# Altium schematic sheet Main_MPPT.SchDoc
size 381 x 241 mm; SheetNumber: 1; SheetTotal: 7
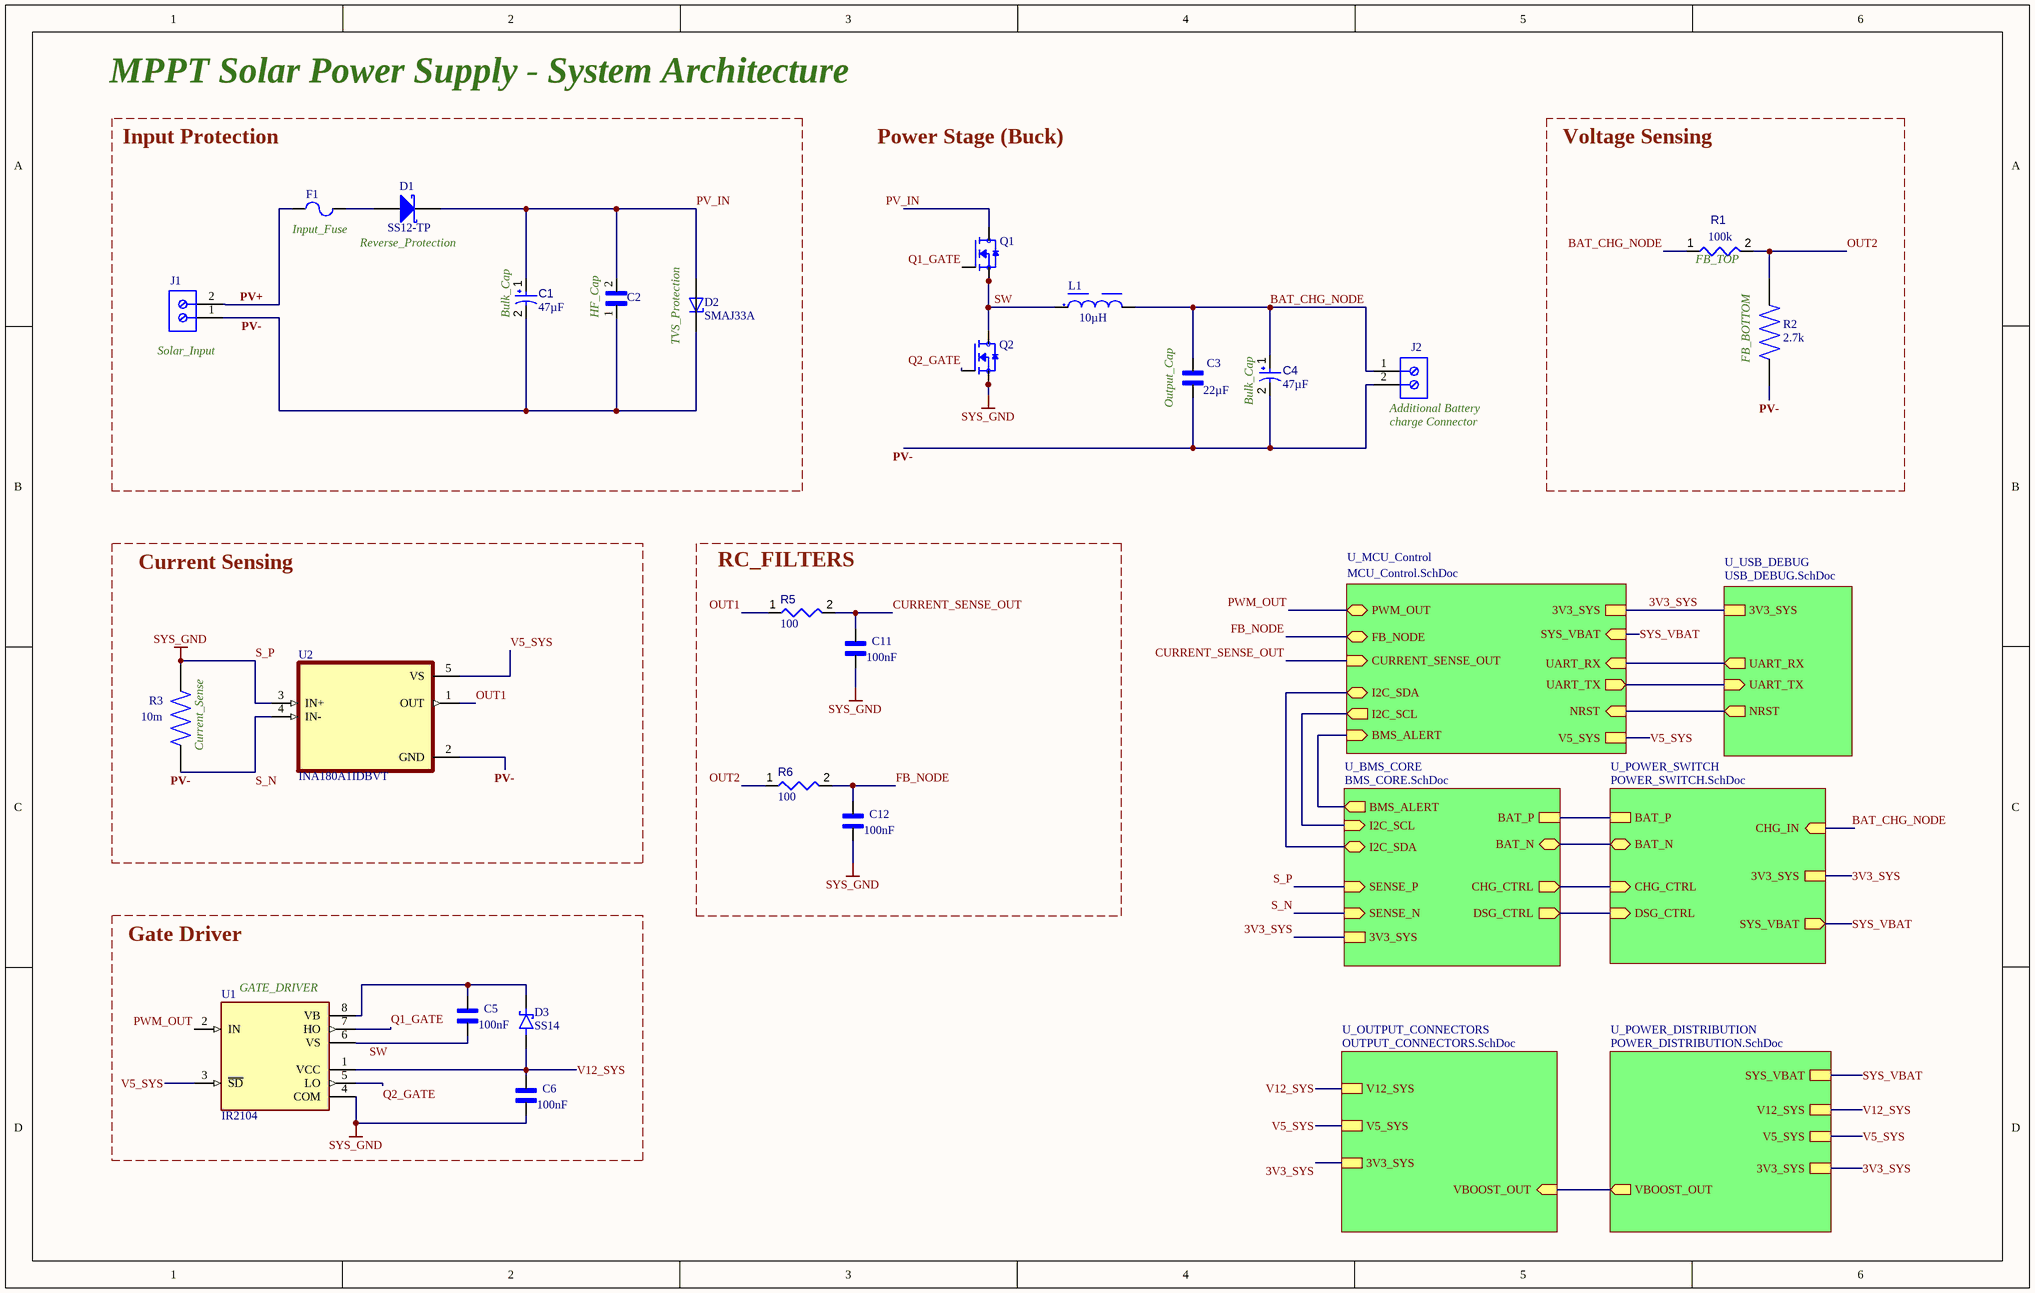
[diagram p0: Main_MPPT.SchDoc]

## Parts
C1  value 47µF  [CAPPR55-250-1120X630X1220]  (hidden comment: ECA1HM470)
C2  C3216X7R1H106K160AE  [CAPC3216X190N]  (value not drawn)
C3  value 22µF  [CAPC3225X270N]  (hidden comment: GRM32ER71E226KE15L)
C4  value 47µF  [CAPPR55-250-1120X630X1220]  (hidden comment: ECA1HM470)
C5  value 100nF  [CAPC1608X90N]  (hidden comment: 0603YC104KAZ2A)
C6  value 100nF  [CAPC1608X90N]  (hidden comment: 0603YC104KAZ2A)
C11  value 100nF  [CAPC1608X90N]  (hidden comment: 0603YC104KAZ2A)
C12  value 100nF  [CAPC1608X90N]  (hidden comment: 0603YC104KAZ2A)
D1  SS12-TP  [MCC-DO-214AC-2_V]
D2  SMAJ33A  [Copy of DIOM4325X250N]
D3  SS14  [DIOM4325X250N]
F1  0154001.DR  [LFUS-0154001.DR_V]  (value not drawn)
J1  691254810002  [691254810002]  (value not drawn)
J2  691254810002  [691254810002]  (value not drawn)
L1  value 10µH  [WE-PD_1260]  (hidden comment: WE-PD_1260)
Q1  CSD18540Q5BT  [TRANS_CSD18540Q5BT]  (value not drawn)
Q2  CSD18540Q5BT  [TRANS_CSD18540Q5BT]  (value not drawn)
R1  value 100k  [RESC0402(1005)_L]  (hidden comment: 100KR2F)
R2  value 2.7k  [RES_ERJ2RHD2702X]  (hidden comment: ERJ2RHD2702X)
R3  value 10m  [RESC6331X88N]  (hidden comment: WSL2512R0100FEA18)
R5  value 100  [RESC0402(1005)_L]  (hidden comment: 100R2F)
R6  value 100  [RESC0402(1005)_L]  (hidden comment: 100R2F)
U1  IR2104  [DIP762W45P254L988H533Q8]
U2  INA180A1IDBVT  [SOT95P280X145-5N]

## Blocks framed on the sheet
Input Protection: C1 C2 D1 D2 F1 J1
Voltage Sensing: R1 R2
Current Sensing: R3 U2
RC_FILTERS: C11 C12 R5 R6
Gate Driver: C5 C6 D3 U1

## Sub-sheets
U_BMS_CORE = BMS_CORE.SchDoc: BAT_N (bidir), BMS_ALERT (out), I2C_SCL (in), I2C_SDA (bidir), CHG_CTRL (out), SENSE_N (in), SENSE_P (in), BAT_P, DSG_CTRL (out), 3V3_SYS
U_MCU_Control = MCU_Control.SchDoc: PWM_OUT (bidir), FB_NODE (bidir), CURRENT_SENSE_OUT (in), I2C_SDA (bidir), I2C_SCL (out), BMS_ALERT (in), 3V3_SYS, V5_SYS, SYS_VBAT (in), UART_TX (out), UART_RX (in), NRST (in)
U_OUTPUT_CONNECTORS = OUTPUT_CONNECTORS.SchDoc: VBOOST_OUT (in), V12_SYS, V5_SYS, 3V3_SYS
U_POWER_DISTRIBUTION = POWER_DISTRIBUTION.SchDoc: SYS_VBAT, V5_SYS, 3V3_SYS, VBOOST_OUT (out), V12_SYS
U_POWER_SWITCH = POWER_SWITCH.SchDoc: CHG_CTRL (in), DSG_CTRL (in), BAT_P, BAT_N (bidir), CHG_IN (in), SYS_VBAT (out), 3V3_SYS
U_USB_DEBUG = USB_DEBUG.SchDoc: 3V3_SYS, UART_TX (in), UART_RX (out), NRST (out)

## Nets
S_P: C6.1 C11.1 C12.1 Q2.1(S) Q2.2(S) Q2.3(S) R3.2 U1.4(COM) U2.3(IN+) ; sheet U_BMS_CORE/SENSE_P  [also labelled SYS_GND]
3V3_SYS: sheet U_MCU_Control/3V3_SYS, sheet U_BMS_CORE/3V3_SYS, sheet U_POWER_SWITCH/3V3_SYS, sheet U_POWER_DISTRIBUTION/3V3_SYS, sheet U_OUTPUT_CONNECTORS/3V3_SYS, sheet U_USB_DEBUG/3V3_SYS
BAT_CHG_NODE: C3.2 C4.1 J2.1 L1.2 R1.1 ; sheet U_POWER_SWITCH/CHG_IN
CURRENT_SENSE_OUT: C11.2 R5.2 ; sheet U_MCU_Control/CURRENT_SENSE_OUT
FB_NODE: C12.2 R6.2 ; sheet U_MCU_Control/FB_NODE
OUT1: R5.1 U2.1(OUT)
OUT2: R1.2 R2.2 R6.1
PV+: F1.1 J1.2
PV-: C1.2 C2.1 C3.1 C4.2 D2.C J1.1 J2.2 R2.1 R3.1 U2.2(GND) U2.4(IN-) ; sheet U_BMS_CORE/SENSE_N  [also labelled S_N]
PV_IN: C1.1 C2.2 D1.2(K) D2.A Q1.5_6_7_8(D)
PWM_OUT: U1.2(IN) ; sheet U_MCU_Control/PWM_OUT
Q1_GATE: Q1.4(G) U1.7(HO)
Q2_GATE: Q2.4(G) U1.5(LO)
SW: C5.1 L1.1 Q1.1(S) Q1.2(S) Q1.3(S) Q2.5_6_7_8(D) U1.6(VS)
SYS_VBAT: sheet U_MCU_Control/SYS_VBAT, sheet U_POWER_SWITCH/SYS_VBAT, sheet U_POWER_DISTRIBUTION/SYS_VBAT
V5_SYS: U1.3(~{SD}) U2.5(VS) ; sheet U_MCU_Control/V5_SYS, sheet U_POWER_DISTRIBUTION/V5_SYS, sheet U_OUTPUT_CONNECTORS/V5_SYS
V12_SYS: C6.2 D3.A U1.1(VCC) ; sheet U_POWER_DISTRIBUTION/V12_SYS, sheet U_OUTPUT_CONNECTORS/V12_SYS
NetC5_2: C5.2 D3.C(K) U1.8(VB)
NetD1_1: D1.1(A) F1.2
(unnamed): sheet U_MCU_Control/I2C_SDA, sheet U_BMS_CORE/I2C_SDA
(unnamed): sheet U_MCU_Control/I2C_SCL, sheet U_BMS_CORE/I2C_SCL
(unnamed): sheet U_MCU_Control/BMS_ALERT, sheet U_BMS_CORE/BMS_ALERT
(unnamed): sheet U_MCU_Control/UART_TX, sheet U_USB_DEBUG/UART_TX
(unnamed): sheet U_MCU_Control/UART_RX, sheet U_USB_DEBUG/UART_RX
(unnamed): sheet U_MCU_Control/NRST, sheet U_USB_DEBUG/NRST
(unnamed): sheet U_BMS_CORE/BAT_N, sheet U_POWER_SWITCH/BAT_N
(unnamed): sheet U_BMS_CORE/CHG_CTRL, sheet U_POWER_SWITCH/CHG_CTRL
(unnamed): sheet U_BMS_CORE/BAT_P, sheet U_POWER_SWITCH/BAT_P
(unnamed): sheet U_BMS_CORE/DSG_CTRL, sheet U_POWER_SWITCH/DSG_CTRL
(unnamed): sheet U_POWER_DISTRIBUTION/VBOOST_OUT, sheet U_OUTPUT_CONNECTORS/VBOOST_OUT

## Notes on the sheet
- MPPT Solar Power Supply - System Architecture
- Power Stage (Buck)
- (near F1) Input_Fuse
- Reverse_Protection
- (near R1) FB_TOP
- (near J1) Solar_Input
- (near C1) Bulk_Cap
- (near C2) HF_Cap
- (near D2) TVS_Protection
- (near R2) FB_BOTTOM
- (near C3) Output_Cap
- (near C4) Bulk_Cap
- (near J2) Additional Battery
- (near J2) charge Connector
- (near R3) Current_Sense
- (near U1) GATE_DRIVER

## Library data of the parts
C1 C4 = CMP-001-00030-7: Aluminum Electrolytic Capacitor, 47 uF, +/- 20%, 50 V, -40 to 85 degC, 2-Pin THD, RoHS, Bulk; Manufacturer: Panasonic; Voltage Rating: 50V; Ripple Current: 130mA; Package Reference: CAPPR55-250-1120X630X1220; Packaging: Bulk; Case/Package: Radial; Pins: 2; Package Description: 2-Pin Radial Lead, Dia 6.3 mm, Height 12.2 mm; Capacitor Type: Electrolytic; Max Operating Temperature: 85°C; Min Operating Temperature: -40°C; Datasheet Version: Rev. 05, 10/2016; Manufacturer URL: http://www.panasonic.com/; RoHS Compliant: True; Lead Pitch: 2.5mm; Package Quantity: 200; Mounting Technology: TH; Ripple Current (AC): 130mA; Datasheet URL: https://industrial.panasonic.com/cdbs/www-data/pdf/RDF0000/ABA0000C1218.pdf; Tolerance: 20%; Diameter: 6.3mm
C2 = C3216X7R1H106K160AE: 10 ÂµF Â±10% 50V Ceramic Capacitor X7R 1206 (3216 Metric); MF: TDK Corporation; SnapEDA_Link: https://www.snapeda.com/parts/C3216X7R1H106K160AE/TDK/view-part/?ref=snap; Check_prices: https://www.snapeda.com/parts/C3216X7R1H106K160AE/TDK/view-part/?ref=eda; Availability: In Stock; Value: *; Price: None; MP: C3216X7R1H106K160AE; Package: 3216 TDK; Purchase-URL: https://pricing.snapeda.com/search/part/C3216X7R1H106K160AE/?ref=eda
C3 = CMP-001-00088-1: SMD capacitor X7R(EIA) with capacitance 22uF Tol.10%. Rated voltage 25Vdc 125C; MF: Murata Electronics; Source: GRM32ER71E226KE15L.SchLib; Component Type: Standard; MP: GRM32ER71E226KE15L; SnapEDA_Link: https://www.snapeda.com/parts/GRM32ER71E226KE15L/Murata+Electronics+North+America/view-part/?ref=snap; Case/Package: 3225 Murata; Design Item ID: GRM32ER71E226KE15L; Check_prices: https://www.snapeda.com/parts/GRM32ER71E226KE15L/Murata+Electronics+North+America/view-part/?ref=eda; Pins: 2
C5 C6 C11 C12 = CMP-001-00089-1: Capacitor MLCC 0603 100nF 16V; MF: AVX; MP: 0603YC104KAZ2A; SnapEDA_Link: https://www.snapeda.com/parts/0603YC104KAZ2A/AVX/view-part/?ref=snap; Case/Package: 1608 AVX; Source: 0603YC104KAZ2A.SchLib; Check_prices: https://www.snapeda.com/parts/0603YC104KAZ2A/AVX/view-part/?ref=eda; Pins: 2; Design Item ID: 0603YC104KAZ2A; Component Type: Standard
D1 = CMP-004-00018-2: Schottky Rectifier, 20 V, 1 A, -55 to 125 degC, 2-Pin DO-214AC, RoHS, Tape and Reel; Manufacturer: Micro Commercial Components; Forward Voltage: 450mV; Max Surge Current: 30A; Forward Current: 1A; Peak Reverse Current: 500uA; Package Quantity: 1; Packaging: CutTape; Datasheet Version: Rev. B, 11/2011; Manufacturer URL: http://www.mccsemi.com/; Max Operating Temperature: 125°C; Pins: 2; Min Operating Temperature: -55°C; Package Reference: DO-214AC-2; Case/Package: SMA; Package Description: 2-Pin Molded Diode, Body 4.315 x 2.705 mm; Mounting Technology: SM; Datasheet URL: http://www.mccsemi.com/up_pdf/SS12-SS110(HSMA).PDF; RoHS Compliant: True
D2 = CMP-004-00069-4: 400W, 38.7V, 5%, Unidirectional, TVS; MF: Taiwan Semiconductor; Check_prices: https://www.snapeda.com/parts/SMAJ33A/taiwan/view-part/?ref=eda; Pins: 2; Value: *; MP: SMAJ33A; SnapEDA_Link: https://www.snapeda.com/parts/SMAJ33A/taiwan/view-part/?ref=snap; Design Item ID: SMAJ33A; Case/Package: SMA-2 Taiwan Semiconductor; Component Type: Standard; Source: SMAJ33A.SchLib
D3 = CMP-004-00070-2: 1A, 40V, Schottky Rectifier; MF: Taiwan Semiconductor; Value: *; MP: SS14; Design Item ID: SS14; Pins: 2; SnapEDA_Link: https://www.snapeda.com/parts/SS14/taiwan/view-part/?ref=snap; Case/Package: SMA-2 Taiwan Semiconductor; Component Type: Standard; Check_prices: https://www.snapeda.com/parts/SS14/taiwan/view-part/?ref=eda; Source: SS14.SchLib
F1 = CMP-2000-05587-1: Very Fast-Acting Fuse, 1 A, -55 to 125 degC, 2-Pin SMD, RoHS, Tape and Reel; Manufacturer: Littelfuse; Body Material: Ceramic,Thermoplastic; Current Rating: 1A; Case Height: 3.81mm; Voltage Rating DC: 60V; Type: Omni-BlokSMD/SMTFuseandHolderAssembly; Voltage Rating: 125V; Case Width: 5.03mm; Voltage Rating AC: 72V; Fuse Size / Group: OMNI-BLOK; Fuse Type: FastBlow; Case Length: 9.73mm; Packaging: Reel; Mounting Technology: SurfaceMount; RoHS: Details; Product Type: SurfaceMountFusewithFuseHolder; Package Description: 2-Pin Surface Mount Device, Body 9.73 x 5.03 mm; Brand: Littelfuse; Series: 154; Package Reference: 154001; Dimensions: 9.73mmLx5.03mmW; Mounting Style: SMD/SMT; Datasheet URL: http://www.littelfuse.com/~/media/electronics/datasheets/fuses/littelfuse_fuse_154_154t_154l_154tl_datasheet.pdf.pdf; Manufacturer URL: http://www.littelfuse.com/; Product Category: SurfaceMountFuses; Datasheet Version: 04/2016; Product: SurfaceMountFuses; Factory Pack Quantity: 1500; Termination Style: SMD/SMT; Operating Temperature Range: -55Cto+125C
J1 J2 = CMP-1502-02805-3: Terminal Block, 10MM Pitch, Horizontal, Rising Cage Clamp, 12-30 AWG, 2 Pin
L1 = CMP-006-00028-2: Power inductor SMD WE-PD L 10.0uH 4.09A; MF: WÃ¼rth Elektronik; MP: 74477110; Design Item ID: WE-PD_1260; Case/Package: Nonstandard Wurth Electronics; Component Type: Standard; Pins: 2; Source: WE-PD_1260.SchLib; Check_prices: https://www.snapeda.com/parts/74477110/W%25C3%25BCrth+Elektronik+Midcom/view-part/?ref=eda; SnapEDA_Link: https://www.snapeda.com/parts/74477110/W%25C3%25BCrth+Elektronik+Midcom/view-part/?ref=snap
Q1 Q2 = CMP-030-000000-1: 60-V, N channel NexFETâ„¢ power MOSFET, single SON 5 mm x 6 mm, 2.2 mOhm; MF: Texas Instruments; Value: 60V; Source: CSD18540Q5BT.SchLib; Pin Count: 5; Package: VSON-CLIP-8 Texas Instruments; Check_prices: https://www.snapeda.com/parts/CSD18540Q5BT/Texas+Instruments/view-part/?ref=eda; Design Item ID: CSD18540Q5BT; MP: CSD18540Q5BT; SnapEDA_Link: https://www.snapeda.com/parts/CSD18540Q5BT/Texas+Instruments/view-part/?ref=snap; Component Type: Standard
R1 = CMP-009-00064-2: 100K 0.063W 1% 0402 (1005 Metric)  SMD; Power: 63mW; Case/Package: 0402; Mounting Technology: SMT; Pins: 2; Tolerance: 1%
R2 = CMP-009-00188-1: ERJ2R Resistor 0.063W 27K 0.5% 50ppm; MF: Panasonic; Pins: 2; Case/Package: 1020-2 Panasonic; Design Item ID: ERJ2RHD2702X; SnapEDA_Link: https://www.snapeda.com/parts/ERJ2RHD2702X/Panasonic/view-part/?ref=snap; Component Type: Standard; Source: ERJ2RHD2702X.SchLib; MP: ERJ2RHD2702X; Check_prices: https://www.snapeda.com/parts/ERJ2RHD2702X/Panasonic/view-part/?ref=eda
R3 = CMP-009-00189-1: METAL STRIP RESISTOR, 0.01OHM, 1%, 2512; Resistance: 0.01ohm; Product Range: WSL High Power Series; Resistor Case / Package: 2512 ^6432 Metric]; Power Rating: 2W; Resistance Tolerance: ± 1%; Resistor Techn 18X4752; MF: Vishay Intertechnology; Check_prices: https://www.snapeda.com/parts/WSL2512R0100FEA18/Vishay/view-part/?ref=eda; SnapEDA_Link: https://www.snapeda.com/parts/WSL2512R0100FEA18/Vishay/view-part/?ref=snap; MP: WSL2512R0100FEA18; Pins: 2; Source: WSL2512R0100FEA18.SchLib; Case/Package: SMD Vishay; Design Item ID: WSL2512R0100FEA18; Component Type: Standard
R5 R6 = CMP-009-00065-2: 100R 0.063W 1% 0402 (1005 Metric)  SMD; Power: 63mW; Tolerance: 1%; Case/Package: 0402; Pins: 2; Mounting Technology: SMT
U1 = CMP-031-06207-1: Half-Bridge Gate Driver IC Non-Inverting 8-PDIP; MF: Infineon Technologies; Check_prices: https://www.snapeda.com/parts/IR2104/Infineon/view-part/?ref=eda; Design Item ID: IR2104; SnapEDA_Link: https://www.snapeda.com/parts/IR2104/Infineon/view-part/?ref=snap; Value: IC; MP: IR2104; Component Type: Standard; Source: IR2104.SchLib; Case/Package: DIP-8 Infineon; Pins: 8
U2 = CMP-038-000000-1: 26V, 350kHz ì „ë¥˜ ê°ì§€ ì; MF: Texas Instruments; Check_prices: https://www.snapeda.com/parts/INA180A1IDBVT/Texas+Instruments/view-part/?ref=eda; Design Item ID: INA180A1IDBVT; Package: SOT-23-5 Texas Instruments; Pin Count: 5; Source: INA180A1IDBVT.SchLib; Value: -; MP: INA180A1IDBVT; Component Type: Standard; SnapEDA_Link: https://www.snapeda.com/parts/INA180A1IDBVT/Texas+Instruments/view-part/?ref=snap